# EAGLE design power-distribution (EAGLE 7.5.0)
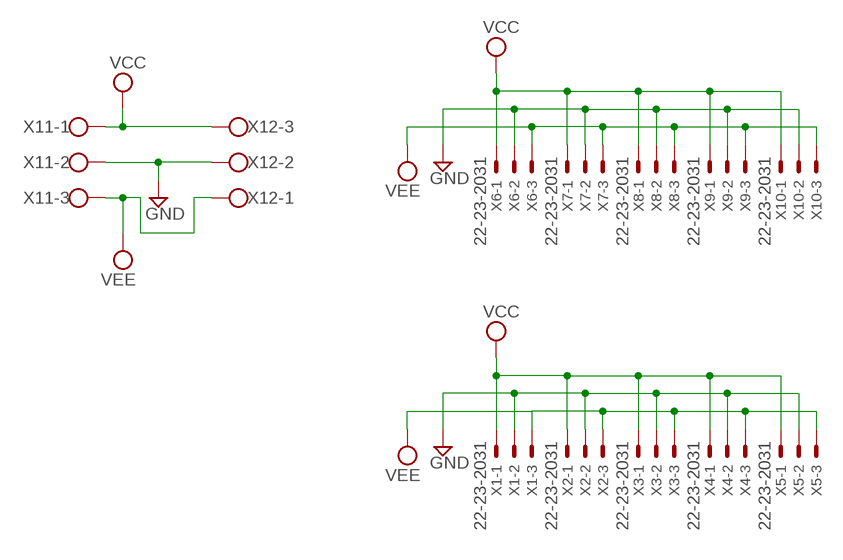
[diagram p0: schematic, sheet 1]

## Parts
X1  22-23-2031  [22-23-2031]
X2  22-23-2031  [22-23-2031]
X3  22-23-2031  [22-23-2031]
X4  22-23-2031  [22-23-2031]
X5  22-23-2031  [22-23-2031]
X6  22-23-2031  [22-23-2031]
X7  22-23-2031  [22-23-2031]
X8  22-23-2031  [22-23-2031]
X9  22-23-2031  [22-23-2031]
X10  22-23-2031  [22-23-2031]
X11  W237-103  [W237-103]
X12  W237-103  [W237-103]

## Nets
GND: X1.2 X2.2 X3.2 X4.2 X5.2 X6.2 X7.2 X8.2 X9.2 X10.2 X11.2 X12.2
VCC: X1.1 X2.1 X3.1 X4.1 X5.1 X6.1 X7.1 X8.1 X9.1 X10.1 X11.1 X12.3
VEE: X1.3 X2.3 X3.3 X4.3 X5.3 X6.3 X7.3 X8.3 X9.3 X10.3 X11.3 X12.1

## Library data of the parts
X1-X10 = con-molex:22-23-2031: .100" (2.54mm) Center Header - 3 Pin; MF: MOLEX; MPN: 22-23-2031; OC_FARNELL: 1462950; OC_NEWARK: 30C0862
X11 X12 = con-wago-500:W237-103: WAGO SCREW CLAMP; MPN: 237-103; OC_FARNELL: unknown; OC_NEWARK: 18M7116

## Board
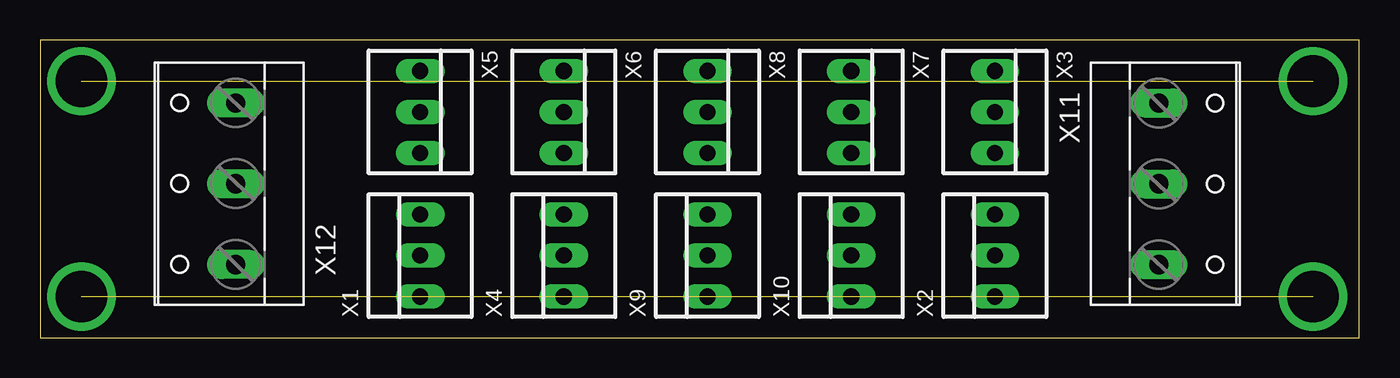
[diagram p1: board, top side]
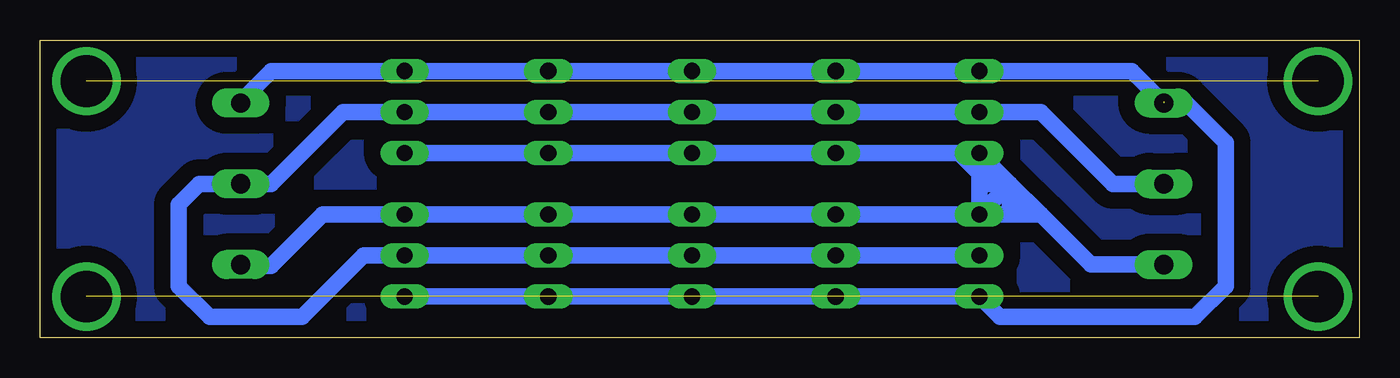
[diagram p2: board, bottom side, seen from below]

Size 81.58 x 18.41 mm. Coordinates in mm from the lower left corner, seen from the top.
Outline: 0,0 81.58,0 81.58,18.41 0,18.41 0,0
Copper layers (1*16): Top 0.035mm / dielectric 1.5mm / Bottom 0.035mm
Design rules "default": minimum track width 10mil, minimum drill 24mil, track to track 8mil, track to pad 8mil, pad to pad 8mil, via to via 8mil, smd to smd 8mil, copper to edge 40mil, drill to drill 8mil, minimum pad ring 10mil, minimum via ring 8mil, stop-mask expansion 4mil, vias tented up to drill 0mil, thermal gap 10mil

### Footprints (pad centres in the part's own frame; a part is rotated, then mirrored left to right if it is on the bottom)
22-23-2031 = drill 1 long: 1 -2.54,0; 2 0,0; 3 2.54,0
W237-103 = drill 1.194 long: 1 -5,-1.29; 2 0,-1.29; 3 5,-1.29

### Placement (x,y rotation side)
X1  23.5,5.08 90 top
X2  59.05,5.08 90 top
X3  59.05,13.97 270 top
X4  32.38,5.08 90 top
X5  23.5,13.97 270 top
X6  32.38,13.97 270 top
X7  50.16,13.97 270 top
X8  41.27,13.97 270 top
X9  41.27,5.08 90 top
X10  50.16,5.08 90 top
X11  70.48,9.53 270 top
X12  10.79,9.53 90 top

### Tracks (layer width: path | path; a pad name or v marks a point on that pad's centre or on a via)
GND
  Bottom 1.016: X12.2 15.24,9.53 19.68,13.97 X5.2 X6.2 X8.2 X7.2 X3.2 62.87,13.97 67.31,9.53 X11.2 71.75,9.53 73.03,8.26 73.03,3.17 71.12,1.27 65.41,1.27 61.59,5.08 X2.2 X10.2 X9.2 X4.2 X1.2
N$1  (via drill 3.2)  (1 unrouted)
  other vias: 2.54,15.88 78.74,15.88
N$2  (via drill 3.2)  (1 unrouted)
  other vias: 2.54,2.54 78.74,2.54
N$3
  pour Bottom (isolate 1.016): 0,19.05 81.28,19.05 81.28,0 0,0
VCC  (1 unrouted)
  Bottom 1.016: X11.1 69.19,14.62 67.31,16.51 X3.1 X7.1 X8.1 X6.1 X5.1 14.07,16.51 X12.3 | X2.1 X10.1 X9.1 X4.1 X1.1 22.23,1.27 10.16,1.27 8.26,3.17 8.26,12.06 10.79,14.61 12.06,14.61
VEE
  Bottom 1.016: X6.3 X8.3 X7.3 X3.3 X6.3 | X9.3 X4.3 X1.3 | X12.1 16.59,4.53 19.68,7.62 | X11.3 69.11,4.45 67.31,4.45 64.14,7.62 X2.3 X10.3 X9.3 | X6.3 24.77,11.43 | 24.77,11.43 X5.3 | X5.3 21.59,9.53 | 21.59,9.53 19.68,7.62 | X9.3 X1.3 | 19.68,7.62 21.59,7.62 | 21.59,7.62 X1.3 | X1.3 23.5,9.53 | 23.5,9.53 23.5,10.16 | 23.5,10.16 X5.3 | X1.3 21.59,9.53 | 23.5,9.53 21.59,9.53 | 21.59,9.53 21.59,7.62 | 21.59,7.62 20.95,8.26 22.86,10.16 23.5,10.16 | 23.5,10.16 24.77,11.43